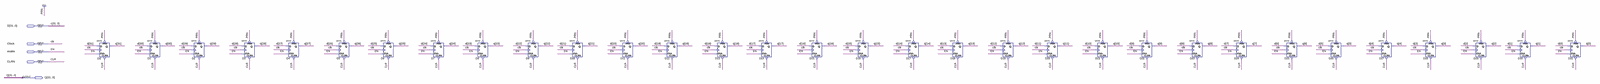
[diagram p0: schematic sheet, whole]
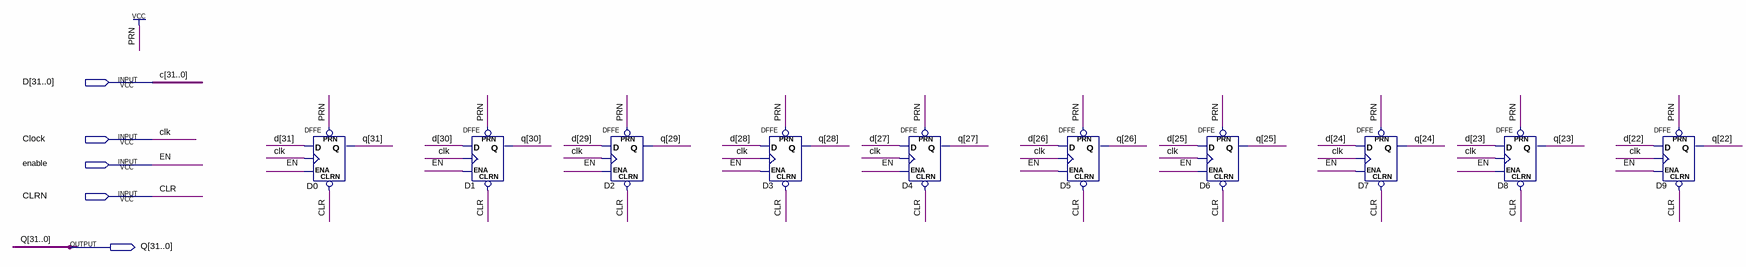
[diagram p1: schematic sheet, left part]
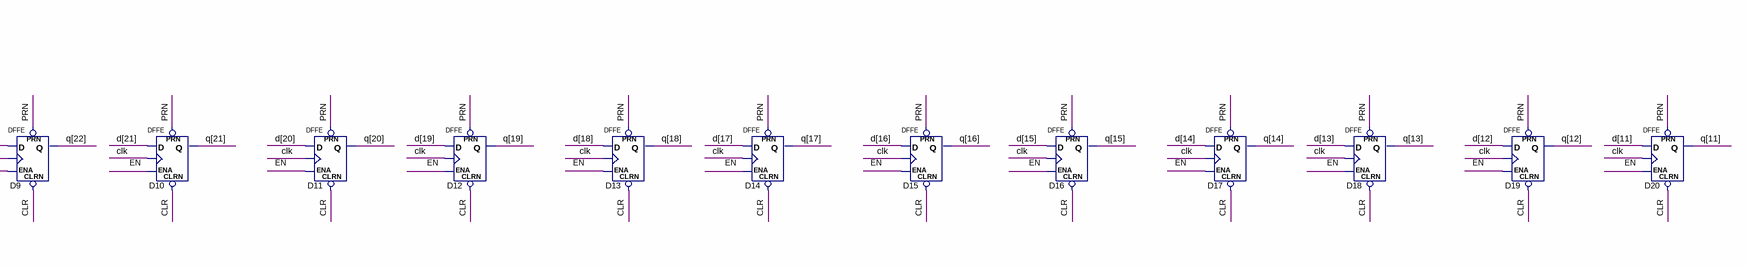
[diagram p2: schematic sheet, centre part]
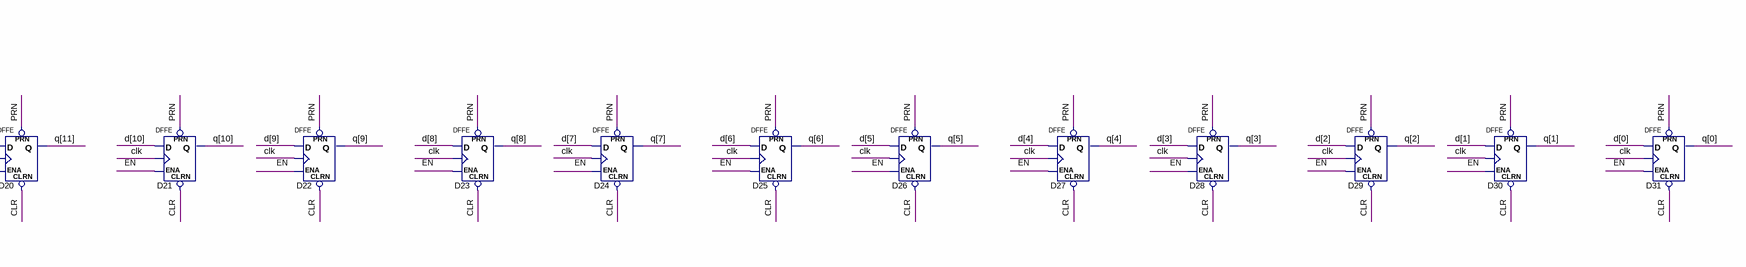
[diagram p3: schematic sheet, right part]
// Quartus schematic reg32bit.bdf as structural Verilog: 32 symbols, 5 pins
module reg32bit (
  input  [31:0] D,
  input  Clock,
  input  enable,
  input  CLRN,
  output [31:0] Q
);

  DFFE D0 (.PRN(1'b1), .CLRN(CLRN), .D(D[31]), .CLK(Clock), .ENA(enable), .Q(Q[31]));
  DFFE D1 (.PRN(1'b1), .CLRN(CLRN), .D(D[30]), .CLK(Clock), .ENA(enable), .Q(Q[30]));
  DFFE D2 (.PRN(1'b1), .CLRN(CLRN), .D(D[29]), .CLK(Clock), .ENA(enable), .Q(Q[29]));
  DFFE D3 (.PRN(1'b1), .CLRN(CLRN), .D(D[28]), .CLK(Clock), .ENA(enable), .Q(Q[28]));
  DFFE D4 (.PRN(1'b1), .CLRN(CLRN), .D(D[27]), .CLK(Clock), .ENA(enable), .Q(Q[27]));
  DFFE D5 (.PRN(1'b1), .CLRN(CLRN), .D(D[26]), .CLK(Clock), .ENA(enable), .Q(Q[26]));
  DFFE D6 (.PRN(1'b1), .CLRN(CLRN), .D(D[25]), .CLK(Clock), .ENA(enable), .Q(Q[25]));
  DFFE D7 (.PRN(1'b1), .CLRN(CLRN), .D(D[24]), .CLK(Clock), .ENA(enable), .Q(Q[24]));
  DFFE D8 (.PRN(1'b1), .CLRN(CLRN), .D(D[23]), .CLK(Clock), .ENA(enable), .Q(Q[23]));
  DFFE D9 (.PRN(1'b1), .CLRN(CLRN), .D(D[22]), .CLK(Clock), .ENA(enable), .Q(Q[22]));
  DFFE D10 (.PRN(1'b1), .CLRN(CLRN), .D(D[21]), .CLK(Clock), .ENA(enable), .Q(Q[21]));
  DFFE D11 (.PRN(1'b1), .CLRN(CLRN), .D(D[20]), .CLK(Clock), .ENA(enable), .Q(Q[20]));
  DFFE D12 (.PRN(1'b1), .CLRN(CLRN), .D(D[19]), .CLK(Clock), .ENA(enable), .Q(Q[19]));
  DFFE D13 (.PRN(1'b1), .CLRN(CLRN), .D(D[18]), .CLK(Clock), .ENA(enable), .Q(Q[18]));
  DFFE D14 (.PRN(1'b1), .CLRN(CLRN), .D(D[17]), .CLK(Clock), .ENA(enable), .Q(Q[17]));
  DFFE D15 (.PRN(1'b1), .CLRN(CLRN), .D(D[16]), .CLK(Clock), .ENA(enable), .Q(Q[16]));
  DFFE D16 (.PRN(1'b1), .CLRN(CLRN), .D(D[15]), .CLK(Clock), .ENA(enable), .Q(Q[15]));
  DFFE D17 (.PRN(1'b1), .CLRN(CLRN), .D(D[14]), .CLK(Clock), .ENA(enable), .Q(Q[14]));
  DFFE D18 (.PRN(1'b1), .CLRN(CLRN), .D(D[13]), .CLK(Clock), .ENA(enable), .Q(Q[13]));
  DFFE D19 (.PRN(1'b1), .CLRN(CLRN), .D(D[12]), .CLK(Clock), .ENA(enable), .Q(Q[12]));
  DFFE D20 (.PRN(1'b1), .CLRN(CLRN), .D(D[11]), .CLK(Clock), .ENA(enable), .Q(Q[11]));
  DFFE D21 (.PRN(1'b1), .CLRN(CLRN), .D(D[10]), .CLK(Clock), .ENA(enable), .Q(Q[10]));
  DFFE D22 (.PRN(1'b1), .CLRN(CLRN), .D(D[9]), .CLK(Clock), .ENA(enable), .Q(Q[9]));
  DFFE D23 (.PRN(1'b1), .CLRN(CLRN), .D(D[8]), .CLK(Clock), .ENA(enable), .Q(Q[8]));
  DFFE D24 (.PRN(1'b1), .CLRN(CLRN), .D(D[7]), .CLK(Clock), .ENA(enable), .Q(Q[7]));
  DFFE D25 (.PRN(1'b1), .CLRN(CLRN), .D(D[6]), .CLK(Clock), .ENA(enable), .Q(Q[6]));
  DFFE D26 (.PRN(1'b1), .CLRN(CLRN), .D(D[5]), .CLK(Clock), .ENA(enable), .Q(Q[5]));
  DFFE D27 (.PRN(1'b1), .CLRN(CLRN), .D(D[4]), .CLK(Clock), .ENA(enable), .Q(Q[4]));
  DFFE D28 (.PRN(1'b1), .CLRN(CLRN), .D(D[3]), .CLK(Clock), .ENA(enable), .Q(Q[3]));
  DFFE D29 (.PRN(1'b1), .CLRN(CLRN), .D(D[2]), .CLK(Clock), .ENA(enable), .Q(Q[2]));
  DFFE D30 (.PRN(1'b1), .CLRN(CLRN), .D(D[1]), .CLK(Clock), .ENA(enable), .Q(Q[1]));
  DFFE D31 (.PRN(1'b1), .CLRN(CLRN), .D(D[0]), .CLK(Clock), .ENA(enable), .Q(Q[0]));

  // Other names for the same wires on the sheet: c[31:0] = D; clk = Clock; CLR = CLRN; EN = enable
endmodule
